# Altium schematic sheet PowerDistribution.SchDoc: Power Distribution
size A4; ApprovedBy: Ekrem Turan Fırat; CheckedBy: Ekrem Turan Fırat; Author: Ekrem Turan Fırat; CompanyName: Mergen Elektronik; DrawnBy: Ekrem T. Fırat; Engineer: Ekrem Turan Fırat; Organization: Mergen Elektronik; Address1: Türkiye; DocumentNumber: 20240101; Revision: v0.0.1; SheetNumber: 3; SheetTotal: 7
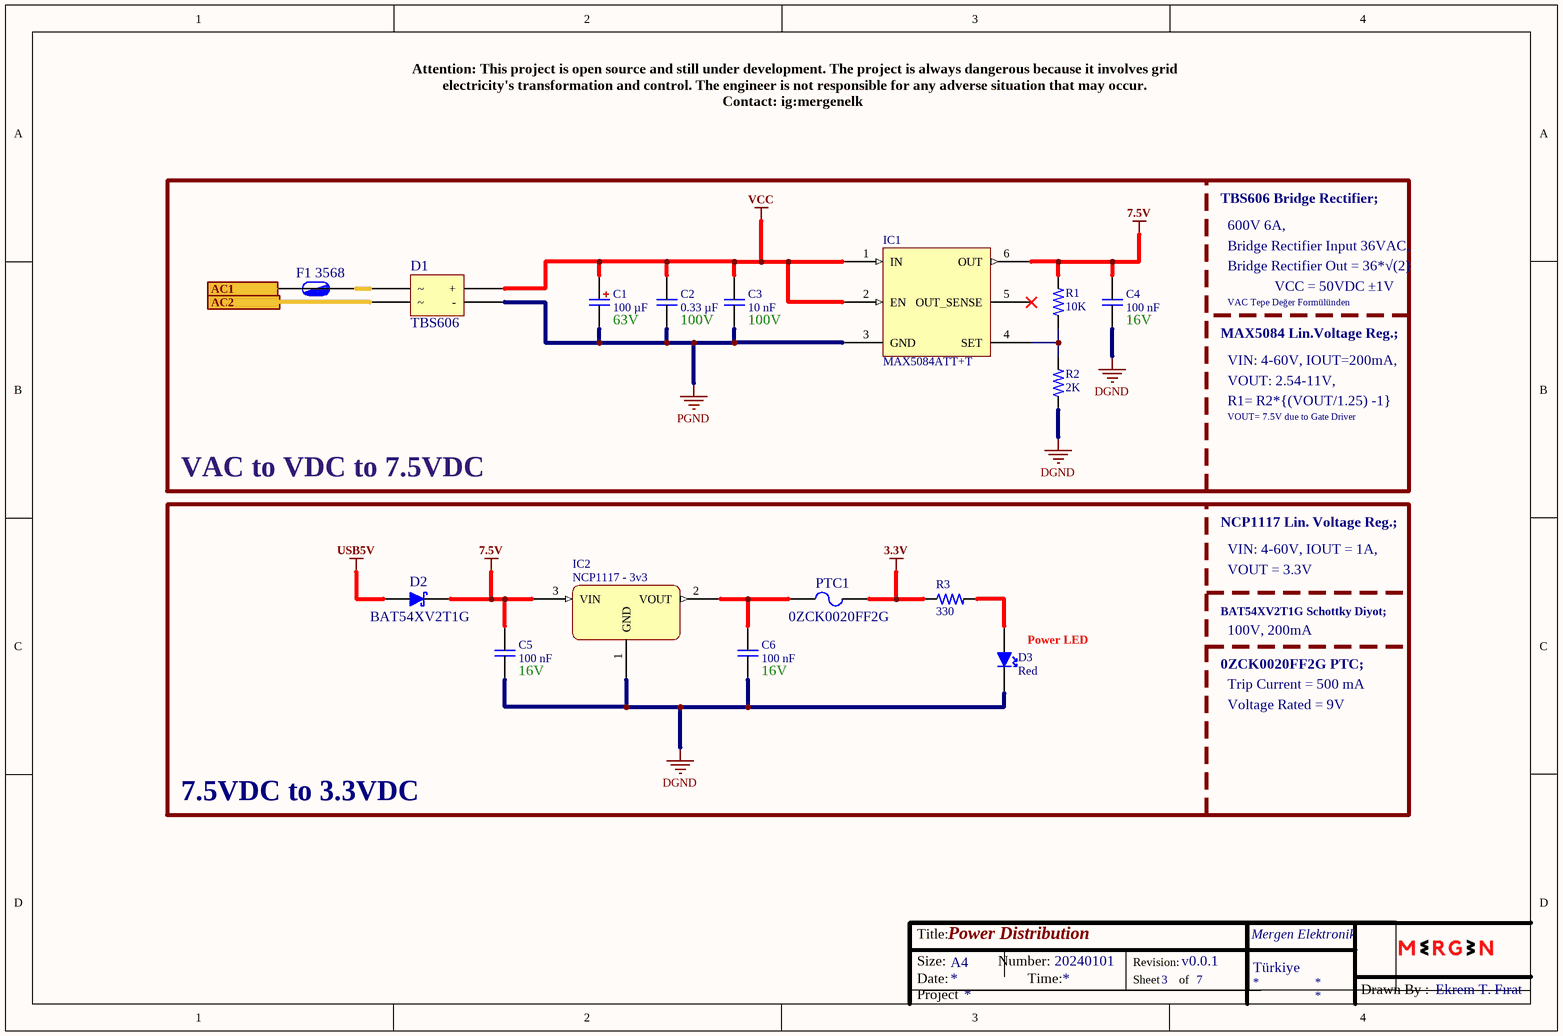
[diagram p0: PowerDistribution.SchDoc]

## Parts
C1  100 µF  Voltage Rated: 63V  [MergenElektronik_Capacitors_AluminumElectrolytics_SMDs_10x10.5mm]
C2  0.33 µF  Voltage Rated: 100V  [MergenElektronik_Capacitors_Ceramics_SMDs_1206_S_NS]
C3  10 nF  Voltage Rated: 100V  [MergenElektronik_Capacitors_Ceramics_SMDs_0603_S_NS]
C4  100 nF  Voltage Rated: 16V  [MergenElektronik_Capacitors_Ceramics_SMDs_0603_S_NS]
C5  100 nF  Voltage Rated: 16V  [MergenElektronik_Capacitors_Ceramics_SMDs_0603_S_NS]
C6  100 nF  Voltage Rated: 16V  [MergenElektronik_Capacitors_Ceramics_SMDs_0603_S_NS]
D1  TBS606  [MergenElektronik_Diodes_BridgeRectifiers_TBS606]
D2  BAT54XV2T1G  [MergenElektronik_Diodes_SchottkyDiodes_SOD-523]
D3  Red  [MergenElektronik_Leds_SMDs_0603_S_NS]
F1  3568  [MergenElektronik_FuseHolders_BladeType_3568]
IC1  MAX5084ATT+T  [MergenElektronik_Regulators_Linears_6-TDFN]
IC2  NCP1117 - 3v3  [MergenElektronik_Regulators_Linears_SOT223]
PTC1  0ZCK0020FF2G  [MergenElektronik_CircuitProtections_PTCs_0603_S_NS]
R1  10K  [MergenElektronik_Resistors_ChipResistors_0603_S_NS]
R2  2K  [MergenElektronik_Resistors_ChipResistors_0603_S_NS]
R3  330  [MergenElektronik_Resistors_ChipResistors_0603_S_NS]

## Blocks framed on the sheet
VAC to VDC to 7.5VDC: C1-C4 D1 F1 IC1 R1 R2
7.5VDC to 3.3VDC: C5 C6 D2 D3 IC2 PTC1 R3

## Ports
AC1 (in), AC2 (in)

## Nets
3.3V: PTC1.2 R3.1
7.5V: C4.1 C5.1 D2.2(KATOT) IC1.6(OUT) IC2.3(VIN) R1.2
DGND: C4.2 C5.2 C6.2 D3.2(KATOT) IC2.1(GND) R2.1
PGND: C1.1 C2.2 C3.2 D1.2(-) IC1.3(GND)
USB5V: D2.1(ANOT)
VCC: C1.2 C2.1 C3.1 D1.1(+) IC1.1(IN) IC1.2(EN)
AC2: D1.4 ; port AC2
NetC6_1: C6.1 IC2.2(VOUT) PTC1.1
NetD1_3: D1.3 F1.2
NetD3_1: D3.1(ANOT) R3.2
NetIC1_4: IC1.4(SET) R1.1 R2.2

Not connected (* = marked no-connect by the designer): F1 1; IC1 5(OUT_SENSE)*

## Notes on the sheet
- Attention: This project is open source and still under development. The project is always dangerous because it involves grid electricity's transformation and control. The engineer is not responsible for any adverse situation that may occur.
  Contact: ig:mergenelk
- TBS606 Bridge Rectifier;
- 600V 6A,
- Bridge Rectifier Input 36VAC,
- Bridge Rectifier Out = 36*√(2)
- VAC Tepe Değer Formülünden
- VCC = 50VDC ±1V
- MAX5084 Lin.Voltage Reg.;
- VIN: 4-60V, IOUT=200mA,
- VOUT: 2.54-11V,
- R1= R2*{(VOUT/1.25) -1}
- VOUT= 7.5V due to Gate Driver
- NCP1117 Lin. Voltage Reg.;
- VIN: 4-60V, IOUT = 1A,
- VOUT = 3.3V
- (near D3) Power LED
- BAT54XV2T1G Schottky Diyot;
- 100V, 200mA
- 0ZCK0020FF2G PTC;
- Trip Current = 500 mA
- Voltage Rated = 9V
- Title:
- Size:
- Date:
- A4
- Number:
- Time:
- Revision:
- Sheet
- of
- Project
- Drawn By :

## Library data of the parts
C1 = MergenElektronik_Capacitors_AluminumElectrolytics_SMDs_UUX1J101MNL1GS: Mergen Elektronik - Capacitors - Aluminum Electrolytics - SMDs - UUX1J101MNL1GS; Manufacturer: Nichicon; Model: Aluminum Electrolytic Capacitors; Tolerance: ±20%; Value: 100 µF; Temperature: -55°C up to +105°C; Digi-Key Number: 493-7453-1-ND; Manufacturer Number: UUX1J101MNL1GS; Package: 10x10.5mm; Farnell Number: 2841944; Mouser Number: 647-UUX1J101MNL1GS; Mounting Type: Surface Mount; Supplier 1: Digikey; Supplier 2: Mouser; Supplier Part Number 1: 493-7453-1-ND; Supplier Part Number 2: 647-UUX1J101MNL1GS
C2 = MergenElektronik_Capacitors_Ceramic_SMDs_0.33µF_100V: Mergen Elektronik - Capacitors - Ceramics - SMDs - 1206 - 0.33 µF - 100V; Manufacturer: TDK Corporation; Manufacturer Number: C3216X7R2A334K130AA; Model: Ceramic Capacitors; Tolerance: ±10%; Value: 0.33 µF; Temperature: -55°C up to +125°C; Digi-Key Number: 445-4464-1-ND; Package: 1206(3216 Metric); Mouser Number: 810-C3216X7R2A334K; Mounting Type: Surface Mount; Farnell Number: 2525186; Supplier 1: Digikey; Supplier 2: Mouser; Supplier Part Number 1: 445-4464-6-ND; Supplier Part Number 2: 810-C3216X7R2A334K
C3 = MergenElektronik_Capacitors_Ceramic_SMDs_10nF_100V: Mergen Elektronik - Capacitors - Ceramics - SMDs - 0603 - 10 nF - 100V; Manufacturer: Murata Electronics; Manufacturer Number: GCM188R72A103KA37D; Model: Ceramic Capacitors; Tolerance: ±10%; Value: 10 nF; Temperature: -55°C up to +125°C; Digi-Key Number: 490-4781-1-ND; Package: 0603(1608 Metric); Mouser Number: 81-GCM188R72A103KA7D; Mounting Type: Surface Mount; Farnell Number: 2470432; Özdisan Number: GCM188R72A103KA37D; Supplier 1: Digikey; Supplier 2: Mouser; Supplier Part Number 1: 490-4781-1-ND; Supplier Part Number 2: 81-GCM188R72A103KA7D
C4-C6 = MergenElektronik_Capacitors_Ceramic_SMDs_100nF_16V: Mergen Elektronik - Capacitors - Ceramics - SMDs - 0603 - 100 nF - 16V; Manufacturer: Samsung; Manufacturer Number: CL10B104KO8NNNC; Model: Ceramic Capacitors; Tolerance: ±10%; Value: 100 nF; Temperature: -55°C up to +125°C; Digi-Key Number: 1276-1005-1-ND; Package: 0603(1608); Mouser Number: 187-CL10B104KO8NNNC; Mounting Type: Surface Mount; Farnell Number: 3013413; Supplier 1: Mouser; Supplier 2: Digi-Key; Supplier Part Number 1: 187-CL10B104KO8NNNC; Supplier Part Number 2: 1276-1005-6-ND; Özdisan Number: CL10B104KO8NNNC
D1 = MergenElektronik_Diodes_BridgeRectifiers_TBS606: Mergen Elektronik - Diodes - Bridge Rectifiers - TBS606; Manufacturer: Taiwan Semiconductor Corporation; Voltage Rated: 600V; Current Rating: 6A; Digi-Key Number: 1801-TBS606TR-ND; Model: Bridge Rectifier; Mounting Type: Surface Mount; Mouser Number: 821-TBS606; Package: TBS606; Temperature: -55°C up to 150°C (TJ); Value: TBS606; Supplier 1: Digikey; Supplier 2: Mouser; Supplier Part Number 1: 1801-TBS606CT-ND; Supplier Part Number 2: 821-TBS606; Manufacturer Number: TBS606
D2 = MergenElektronik_Diodes_SchottkyDiodes_BAT54XV2T1G: Mergen Elektronik - Diodes - Schottky Diodes - BAT54XV2T1G; Manufacturer: onsemi; Voltage Rated: 100V; Current Rating: 200mA; Value: VSSB7L45-M3/52T; Digi-Key Number: BAT54XV2T1GOSCT-ND; Manufacturer Number: BAT54XV2T1G; Model: Schottky Diodes; Mounting Type: Surface Mount; Package: SOD-523; Temperature: -55°C up to +150°C; Mouser Number: 863-BAT54XV2T1G; Farnell Number: 1459034; Supplier 1: Digikey; Supplier 2: Mouser; Supplier Part Number 1: BAT54XV2T1GOSCT-ND; Supplier Part Number 2: 863-SBAT54XV2T1G
D3 = MergenElektronik_LEDs_SMDs_Red_0603: Mergen Elektronik - Leds - SMDs - Red - 0603; Manufacturer: Würth Elektronik; Manufacturer Number: 150060RS75000; Voltage Rated: 2V; Model: SMD Leds; Value: Red; Temperature: -45°C up to +85°C; Digi-Key Number: 732-4978-1-ND; Package: 0603(1608); Farnell Number: 2322071; Mouser Number: 710-150060RS75000; Mounting Type: Surface Mount; Color: Red; Özdisan Number: 150060RS75000; Supplier 1: Digi-Key; Supplier 2: Mouser; Supplier Part Number 1: 732-4978-1-ND; Supplier Part Number 2: 710-150060RS75000
F1 = MergenElektronik_FuseHolders_BladeType_3568: Mergen Elektronik - Fuse Holder - Blade Type - 3568; Manufacturer: Keystone; Voltage Rated: 500V; Current Rating: 30A; Digi-Key Number: 36-3568-ND; Model: Blade Type; Mounting Type: THT; Mouser Number: 534-3568; Package: 3568; Temperature: -50°C up to+145°C; Value: 3568; Farnell Number: 2504685; Supplier 1: Digi-Key; Supplier 2: Mouser; Supplier Part Number 1: 36-3568-ND; Supplier Part Number 2: 534-3568; Manufacturer Number: 3568
IC1 = MergenElektronik_Regulators_Linears_MAX5084ATT+T: Mergen Elektronik - Regulators - Linears - MAX5084ATT+T; Manufacturer: Analog Devices Inc./Maxim Integrated; Current Rating: 200mA; Model: Linear; Output Voltage: 2.54V up to 11V; Voltage Rated: 4V up to 65V; Temperature: -40°C up to +125°C; Value: MAX5084ATT+T; Mounting Type: Surface Mount; Digi-Key Number: MAX5084ATT+TR-ND; Manufacturer Number: MAX5084ATT+T; Mouser Number: 700-MAX5084ATTT; Farnell Number: 2514348; Package: 6-TDFN; Supplier 1: Digikey; Supplier 2: Mouser; Supplier Part Number 1: MAX5084ATT+CT-ND; Supplier Part Number 2: 700-MAX5084ATTT
IC2 = MergenElektronik_Regulators_Linears_NCP1117ST33T3G: Mergen Elektronik - Regulators - Linears - NCP1117ST33T3G; Manufacturer: onsemi; Current Rating: 1A; Voltage Rated: 4.75VDC up to 10V; Model: Linear; Output Voltage: 3.3V; Temperature: 0°C up to +125°C; Value: NCP1117ST33T3G; Mounting Type: Surface Mount; Digi-Key Number: NCP1117ST33T3GOSCT-ND; Manufacturer Number: NCP1117ST33T3G; Mouser Number: 863-NCP1117ST33T3G; Özdisan Number: NCP1117ST33T3G; Supplier 1: Digi-Key; Supplier 2: Mouser; Supplier Part Number 1: NCP1117ST33T3GOSCT-ND; Supplier Part Number 2: 863-NCP1117ST33T3G; Package: SOT-223
PTC1 = MergenElektronik_CircuitProtections_PTCs_0ZCK0020FF2G: Mergen Elektronik - Circuit Protections - PTCs - 0ZCK0020FF2G; Manufacturer: Bel Fuse; Model: PTC Fuse; Voltage Rated: 9V; Current Rating: 500 mA; Current - Max: 100A; Current - Hold: 200 mA; Digi-Key Number: 507-1811-1-ND; Manufacturer Number: 0ZCK0020FF2G; Mounting Type: Surface Mount; Mouser Number: 530-0ZCK0020FF2G; Package: 0805(2012); Temperature: -40°C up to 85°C; Value: 0ZCK0020FF2G; Current - Trip: 500 mA; Supplier 1: Digi-Key; Supplier 2: Mouser; Supplier Part Number 1: 507-1811-6-ND; Supplier Part Number 2: 530-0ZCK0020FF2G
R1 = MergenElektronik_Resistors_ChipResistors_0603_10K: Mergen Elektronik - Resistors - Chip Resistors - 0603 - 10K; Manufacturer: Stackpole; Manufacturer Number: RMCF0603JT10K0; Value: Chip Resistor - 0603 - 10K; Power: 1/10W; Tolerance: ±5%; Package: 0603(1608); Temperature: -55°C up to +155°C - X8R; Model: Chip Resistor; Digi-Key Number: RMCF0603JT10K0CT-ND; Mounting Type: Surface Mount; Supplier 1: Digi-Key; Supplier Part Number 1: RMCF0603JT10K0-ND
R2 = MergenElektronik_Resistors_ChipResistors_0603_2K: Mergen Elektronik - Resistors - Chip Resistors - 0603 - 2K; Manufacturer: Panasonix; Manufacturer Number: ERJ-3EKF2001V; Value: Chip Resistor - 0603 - 2K; Power: 1/10W; Tolerance: ±1%; Package: 0603(1608); Temperature: -55°C up to +155°C - X8R; Model: Chip Resistor; Digi-Key Number: P2.00KHCT-ND; Mounting Type: Surface Mount; Mouser Number: 667-ERJ-3EKF2001V; Özdisan Number: ERJ-3EKF2001V; Farnell Number: 2059343; Supplier 1: Digikey; Supplier 2: Mouser; Supplier Part Number 1: P2.00KHDKR-ND; Supplier Part Number 2: 667-ERJ-3EKF2001V
R3 = MergenElektronik_Resistors_ChipResistors_0603_330R: Mergen Elektronik - Resistors - Chip Resistors - 0603 - 330R; Manufacturer: Stackpole; Manufacturer Number: RMCF0603JT330R; Value: Chip Resistor - 0603 - 330R; Power: 1/10W; Tolerance: ±5%; Package: 0603(1608); Temperature: -55°C up to +155°C - X8R; Model: Chip Resistor; Digi-Key Number: RMCF0603JT330RCT-ND; Mounting Type: Surface Mount; Supplier 1: Digi-Key; Supplier Part Number 1: RMCF0603JT330RCT-ND